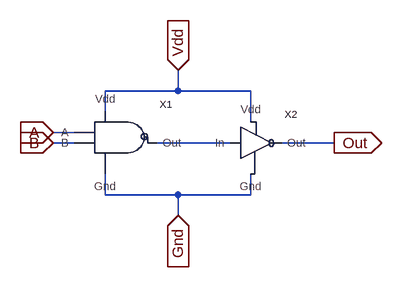
[diagram p0: schematic AND.asc]
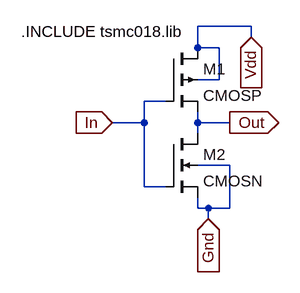
[diagram p1: sub-circuit not.asc]
AND.asc, the LTspice schematic file:
Version 4
SHEET 1 880 680
WIRE 208 96 208 64
WIRE 208 96 96 96
WIRE 320 96 208 96
WIRE 96 128 96 96
WIRE 320 144 320 96
WIRE 48 160 16 160
WIRE 48 176 16 176
WIRE 288 176 176 176
WIRE 448 176 368 176
WIRE 96 256 96 224
WIRE 208 256 96 256
WIRE 320 256 320 224
WIRE 320 256 208 256
WIRE 208 288 208 256
FLAG 16 160 A
IOPIN 16 160 In
FLAG 16 176 B
IOPIN 16 176 In
FLAG 208 64 Vdd
IOPIN 208 64 In
FLAG 208 288 Gnd
IOPIN 208 288 In
FLAG 448 176 Out
IOPIN 448 176 Out
SYMBOL NAND 128 208 R0
SYMATTR InstName X1
SYMBOL NOT 352 208 R0
SYMATTR InstName X2

not.asc, the sub-circuit schematic file:
Version 4
SHEET 1 880 680
WIRE 224 32 144 32
WIRE 224 48 224 32
WIRE 144 64 144 32
WIRE 176 64 144 64
WIRE 176 112 176 64
WIRE 176 112 144 112
WIRE 96 144 64 144
WIRE 64 176 64 144
WIRE 64 176 16 176
WIRE 144 176 144 160
WIRE 192 176 144 176
WIRE 144 192 144 176
WIRE 192 240 144 240
WIRE 64 272 64 176
WIRE 96 272 64 272
WIRE 144 304 144 288
WIRE 160 304 144 304
WIRE 192 304 192 240
WIRE 192 304 160 304
WIRE 160 320 160 304
FLAG 160 320 Gnd
IOPIN 160 320 In
FLAG 192 176 Out
IOPIN 192 176 Out
FLAG 224 48 Vdd
IOPIN 224 48 In
FLAG 16 176 In
IOPIN 16 176 In
SYMBOL cmosp 96 64 R0
SYMATTR InstName M1
SYMATTR Value2 l=180n w=800n
SYMBOL cmosn 96 192 R0
SYMATTR InstName M2
SYMATTR Value2 l=180n w=400n
TEXT -120 40 Left 2 !.INCLUDE tsmc018.lib

The netlist it stands for:
* AND.asc
XX1 A B Vdd N001 Gnd NAND  ; pins A B Vdd Out Gnd
XX2 N001 Out Vdd Gnd not

* block symbol definitions
.subckt not In Out Vdd Gnd
M1 Vdd In Out Vdd CMOSP l=180n w=800n
M2 Out In Gnd Gnd CMOSN l=180n w=400n
.INCLUDE tsmc018.lib
.ends not

.model NMOS NMOS
.model PMOS PMOS
.lib standard.mos
.backanno
.end